# Altium schematic sheet 02_rf_front_end.SchDoc
size A3; SheetNumber: 2; SheetTotal: 2
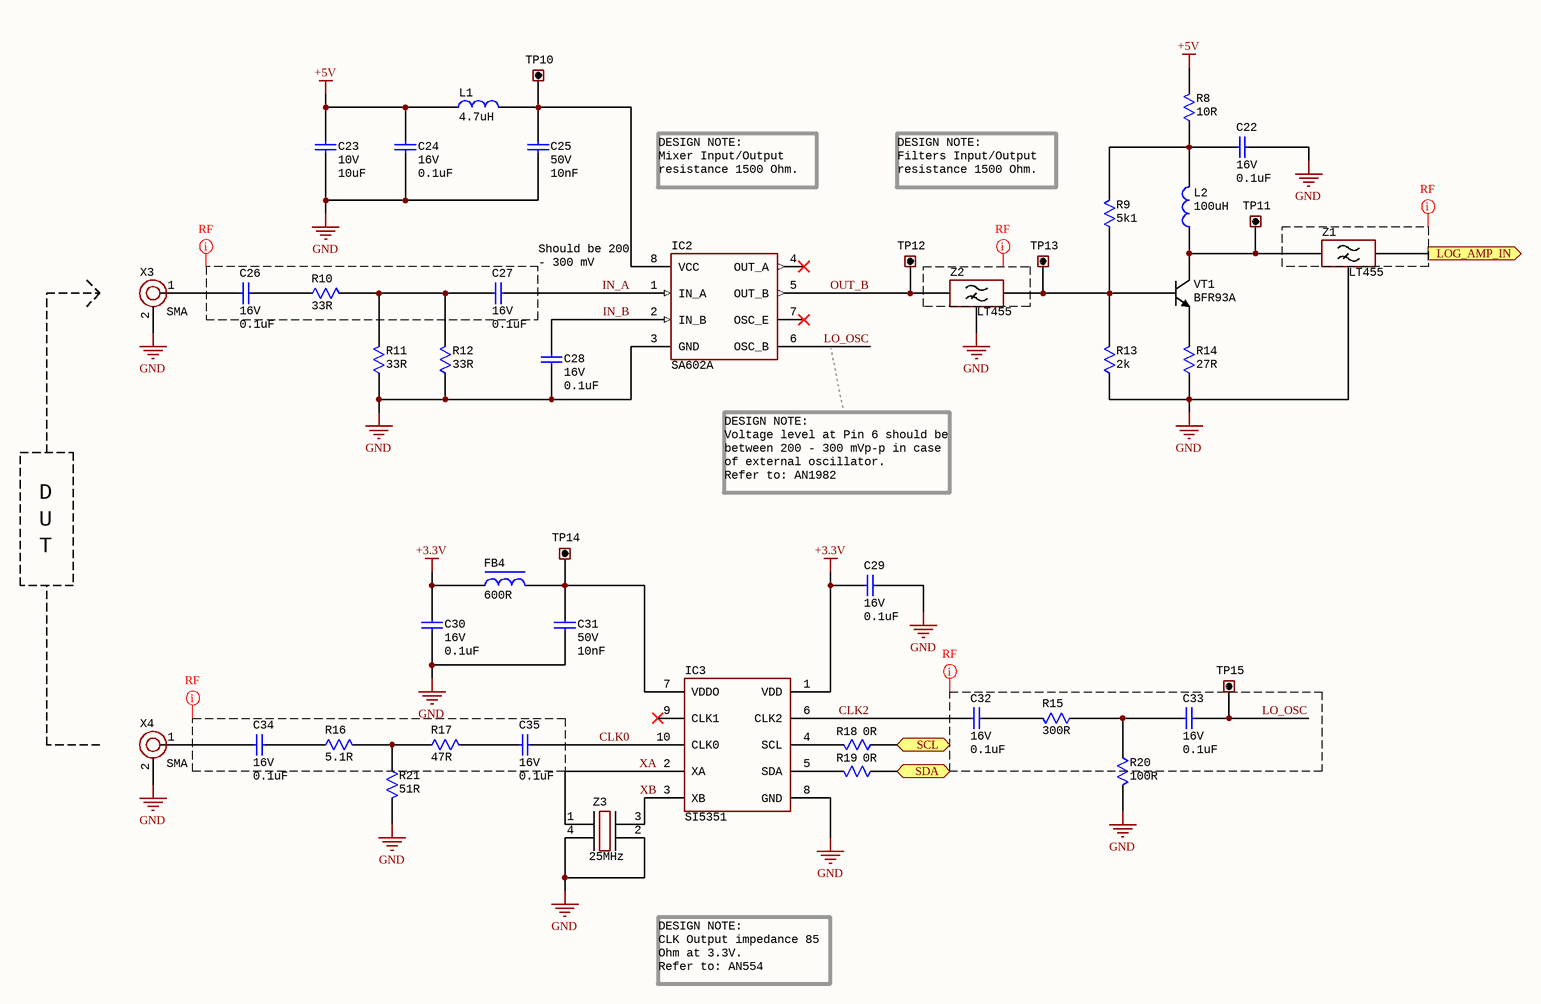
[diagram p0: 02_rf_front_end.SchDoc]

## Parts
C22  value 0.1uF  Voltage: 16V  [CAP: 0402]
C23  value 10uF  Voltage: 10V  [CAP: 0603]
C24  value 0.1uF  Voltage: 16V  [CAP: 0402]
C25  value 10nF  Voltage: 50V  [CAP: 0402]
C26  value 0.1uF  Voltage: 16V  [CAP: 0402]
C27  value 0.1uF  Voltage: 16V  [CAP: 0402]
C28  value 0.1uF  Voltage: 16V  [CAP: 0402]
C29  value 0.1uF  Voltage: 16V  [CAP: 0402]
C30  value 0.1uF  Voltage: 16V  [CAP: 0402]
C31  value 10nF  Voltage: 50V  [CAP: 0402]
C32  value 0.1uF  Voltage: 16V  [CAP: 0402]
C33  value 0.1uF  Voltage: 16V  [CAP: 0402]
C34  value 0.1uF  Voltage: 16V  [CAP: 0402]
C35  value 0.1uF  Voltage: 16V  [CAP: 0402]
FB4  Resistance: 600R  [IND: 0603]
IC2  SA602A  [8-SOIC]
IC3  SI5351  [10-MSOP]
L1  value 4.7uH  [IND: 0603]
L2  value 100uH  [IND: 0805]
R8  value 10R  [RES: 0603]
R9  value 5k1  [RES: 0603]
R10  value 33R  [RES: 0603]
R11  value 33R  [RES: 0603]
R12  value 33R  [RES: 0603]
R13  value 2k  [RES: 0603]
R14  value 27R  [RES: 0603]
R15  value 300R  [RES: 0603]
R16  value 5.1R  [RES: 0603]
R17  value 47R  [RES: 0603]
R18  value 0R  [RES: 0402]  (no BOM)
R19  value 0R  [RES: 0402]  (no BOM)
R20  value 100R  [RES: 0603]
R21  value 51R  [RES: 0603]
TP10  (no value)  [CON: test_point]  (no BOM)
TP11  (no value)  [CON: test_point]  (no BOM)
TP12  (no value)  [CON: test_point]  (no BOM)
TP13  (no value)  [CON: test_point]  (no BOM)
TP14  (no value)  [CON: test_point]  (no BOM)
TP15  (no value)  [CON: test_point]  (no BOM)
VT1  PartNumber: BFR93A  [SOT23]
X3  CommentText: SMA  [CON: SMA EDGE MOUNT]
X4  CommentText: SMA  [CON: SMA EDGE MOUNT]
Z1  (no value)  [CFUKG455]
Z2  (no value)  [CFUKG455]
Z3  Frequency: 25MHz  [OSC: 3225]

## Ports
LOG_AMP_IN (out, see 01_digital_back_end[1C]), SCL (bidir, see 01_digital_back_end[7C]), SDA (bidir, see 01_digital_back_end[7C])

## Nets
+3.3V: C29.1 C30.1 FB4.2 IC3.1(VDD)
+5V: C23.1 C24.1 L1.2 R8.2
GND: C22.2 C23.2 C24.2 C25.2 C28.1 C29.2 C30.2 C31.2 IC2.3(GND) IC3.8(GND) R11.1 R12.1 R13.1 R14.1 R20.1 R21.1 X3.2 X4.2 Z1.3(GND) Z2.3(GND) Z3.2 Z3.4
CLK0: C35.1 IC3.10(CLK0)
CLK2: C32.2 IC3.6(CLK2)
IN_A: C27.2 IC2.1(IN_A)
IN_B: C28.2 IC2.2(IN_B)
LO_OSC: C33.1 IC2.6(OSC_B) TP15.1
LOG_AMP_IN: Z1.2(OUT) ; port LOG_AMP_IN
OUT_B: IC2.5(OUT_B) TP12.1 Z2.1(IN)
SCL: R18.1 ; port SCL
SDA: R19.1 ; port SDA
XA: IC3.2(XA) Z3.1
XB: IC3.3(XB) Z3.3
NetC22_1: C22.1 L2.1 R8.1 R9.2
NetC25_1: C25.1 IC2.8(VCC) L1.1 TP10.1
NetC26_1: C26.1 X3.1
NetC26_2: C26.2 R10.1
NetC27_1: C27.1 R10.2 R11.2 R12.2
NetC31_1: C31.1 FB4.1 IC3.7(VDDO) TP14.1
NetC32_1: C32.1 R15.1
NetC33_2: C33.2 R15.2 R20.2
NetC34_1: C34.1 R16.2
NetC34_2: C34.2 X4.1
NetC35_2: C35.2 R17.1
NetIC3_4: IC3.4(SCL) R18.2
NetIC3_5: IC3.5(SDA) R19.2
NetL2_2: L2.2 TP11.1 VT1.3(C) Z1.1(IN)
NetR9_1: R9.1 R13.2 TP13.1 VT1.1(B) Z2.2(OUT)
NetR14_2: R14.2 VT1.2(E)
NetR16_1: R16.1 R17.2 R21.2

Not connected (* = marked no-connect by the designer): IC2 4(OUT_A)* 7(OSC_E)*; IC3 9(CLK1)*

## Layout directives
net class RF: (no net found under the mark), LO_OSC

## Notes on the sheet
- DESIGN NOTE:
  Mixer Input/Output resistance 1500 Ohm.
- DESIGN NOTE:
  Filters Input/Output resistance 1500 Ohm.
- Should be 200 - 300 mV
- D
- U
- DESIGN NOTE:
  Voltage level at Pin 6 should be between 200 - 300 mVp-p in case of external oscillator.
  Refer to: AN1982
- T
- DESIGN NOTE:
  CLK Output impedance 85 Ohm at 3.3V.
  Refer to: AN554

## Library data of the parts
C22 C24 C26-C30 C32-C35 = Ceramic: Manufacturer: Samsung Electro-Mechanics; PartNumber: CL05B104KO5NNNC; ValueManufacturerPartNumber: Ceramic capacitor, 0.1uF, X7R, ±10%, 16V, 0402, -55...+125°C; TypeCapacitor: Ceramic capacitor; Tolerance: ±10%; TypeDielectric: X7R; Package: 0402; HelpURL: https://jlcpcb.com/partdetail/1877-CL05B104KO5NNNC/C1525; Temperature: -55...+125°C; JLCPCB Part #: C1525
C23 = Ceramic: Manufacturer: Samsung Electro-Mechanics; PartNumber: CL10A106KP8NNNC; ValueManufacturerPartNumber: Ceramic capacitor, 10uF, X5R, ±10%, 10V, 0603, -55...+125°C; TypeCapacitor: Ceramic capacitor; Tolerance: ±10%; TypeDielectric: X5R; Package: 0603; HelpURL: https://jlcpcb.com/partdetail/20411-CL10A106KP8NNNC/C19702; Temperature: -55...+125°C; JLCPCB Part #: C19702
C25 C31 = Ceramic: Manufacturer: Samsung Electro-Mechanics; PartNumber: CL05B103KB5NNNC; ValueManufacturerPartNumber: Ceramic capacitor, 10nF, X7R, ±10%, 50V, 0402, -55...+125°C; TypeCapacitor: Ceramic capacitor; Tolerance: ±10%; TypeDielectric: X7R; Package: 0402; HelpURL: https://jlcpcb.com/partdetail/15869-CL05B103KB5NNNC/C15195; Temperature: -55...+125°C; JLCPCB Part #: C15195
FB4 = Ferrite_Bead_SMD: Manufacturer: Sunlord; PartNumber: LQP03TNR10J02D; TypeInductor: Ferrite Bead; MaxCurrent: 200mA; Frequency: 100 MHz; Package: 0603; HelpURL: https://www.digikey.com/product-detail/en/murata-electronics-north-america/LQP03TNR10J02D/490-6742-1-ND/3845939; ValueManufacturerPartNumber: =TypeInductor+', '+Value+', '+Tolerance+', '+Package+', '+MaxCurrent+', '+Temperature; Temperature: -55...+125°C; JLCPCB Part #: C1002
IC2 = SA602A: Integrated Circuit; Manufacturer_Name: NXP; Manufacturer_Part_Number: SA602AD/01,118; Datasheet Link: http://www.nxp.com/docs/en/data-sheet/SA602A.pdf; Height: 1.75mm; Mouser Part Number: 771-SA602AD/01-T; Mouser Price/Stock: https://www.mouser.co.uk/ProductDetail/NXP-Semiconductors/SA602AD-01118?qs=LOCUfHb8d9uqq1xhBWuUZQ%3D%3D; Arrow Part Number: SA602AD/01,118; Arrow Price/Stock: https://www.arrow.com/en/products/sa602ad01118/nxp-semiconductors?region=nac
IC3 = Si5351A: Integrated Circuit; Manufacturer_Name: Silicon Labs; Manufacturer_Part_Number: Si5351A-B-GT; Datasheet Link: https://componentsearchengine.com/Datasheets/1/Si5351A-B-GT.pdf; Height: 1.1mm; Mouser Part Number: 634-SI5351A-B-GT; Mouser Price/Stock: https://www.mouser.co.uk/ProductDetail/Silicon-Labs/SI5351A-B-GT?qs=p9T7GgSe1IEO%252BMfC%2FKPFfA%3D%3D; Arrow Part Number: SI5351A-B-GT; Arrow Price/Stock: https://www.arrow.com/en/products/si5351a-b-gt/silicon-labs; JLCPCB Part #: C504891
L1 = Inductor_SMD: Manufacturer: Murata Electronics; PartNumber: LQP03TNR10J02D; ValueManufacturerPartNumber: Fixed inductor, 4.7uH, ±5%, 0201, 80mA, -55...+125°C; TypeInductor: Fixed inductor; MaxCurrent: 80mA; Tolerance: ±5%; Package: 0201; HelpURL: https://www.digikey.com/product-detail/en/murata-electronics-north-america/LQP03TNR10J02D/490-6742-1-ND/3845939; Temperature: -55...+125°C; JLCPCB Part #: C1034
L2 = Inductor_SMD: Manufacturer: Murata Electronics; PartNumber: LQP03TNR10J02D; ValueManufacturerPartNumber: Fixed inductor, 100uH, ±5%, 0201, 80mA, -55...+125°C; TypeInductor: Fixed inductor; MaxCurrent: 80mA; Tolerance: ±5%; Package: 0201; HelpURL: https://www.digikey.com/product-detail/en/murata-electronics-north-america/LQP03TNR10J02D/490-6742-1-ND/3845939; Temperature: -55...+125°C
R8 = Resistor: Manufacturer: Yageo; PartNumber: RC0201JR-07100RL; ValueManufacturerPartNumber: Resistor film, 10R, ±5%, 0603, 0.05W, -55...+125°C; TypeResistor: Resistor film; Power: 0.05W; Tolerance: ±5%; Package: 0603; HelpURL: https://www.digikey.com/product-detail/en/yageo/RC0201JR-07100RL/311-100NCT-ND/1949006; Temperature: -55...+125°C
R9 = Resistor: Manufacturer: Yageo; PartNumber: RC0201JR-07100RL; ValueManufacturerPartNumber: Resistor film, 5k1, ±5%, 0603, 0.05W, -55...+125°C; TypeResistor: Resistor film; Power: 0.05W; Tolerance: ±5%; Package: 0603; HelpURL: https://www.digikey.com/product-detail/en/yageo/RC0201JR-07100RL/311-100NCT-ND/1949006; Temperature: -55...+125°C; JLCPCB Part #: C23186
R10-R12 = Resistor: Manufacturer: Yageo; PartNumber: RC0201JR-07100RL; ValueManufacturerPartNumber: Resistor film, 33R, ±5%, 0603, 0.05W, -55...+125°C; TypeResistor: Resistor film; Power: 0.05W; Tolerance: ±5%; Package: 0603; HelpURL: https://www.digikey.com/product-detail/en/yageo/RC0201JR-07100RL/311-100NCT-ND/1949006; Temperature: -55...+125°C; JLCPCB Part #: C23140
R13 = Resistor: Manufacturer: Yageo; PartNumber: RC0201JR-07100RL; ValueManufacturerPartNumber: Resistor film, 2k, ±5%, 0603, 0.05W, -55...+125°C; TypeResistor: Resistor film; Power: 0.05W; Tolerance: ±5%; Package: 0603; HelpURL: https://www.digikey.com/product-detail/en/yageo/RC0201JR-07100RL/311-100NCT-ND/1949006; Temperature: -55...+125°C; JLCPCB Part #: C22975
R14 = Resistor: Manufacturer: Yageo; PartNumber: RC0201JR-07100RL; ValueManufacturerPartNumber: Resistor film, 27R, ±5%, 0603, 0.05W, -55...+125°C; TypeResistor: Resistor film; Power: 0.05W; Tolerance: ±5%; Package: 0603; HelpURL: https://www.digikey.com/product-detail/en/yageo/RC0201JR-07100RL/311-100NCT-ND/1949006; Temperature: -55...+125°C; JLCPCB Part #: C25190
R15 = Resistor: Manufacturer: Yageo; PartNumber: RC0201JR-07100RL; ValueManufacturerPartNumber: Resistor film, 300R, ±5%, 0603, 0.05W, -55...+125°C; TypeResistor: Resistor film; Power: 0.05W; Tolerance: ±5%; Package: 0603; HelpURL: https://www.digikey.com/product-detail/en/yageo/RC0201JR-07100RL/311-100NCT-ND/1949006; Temperature: -55...+125°C; JLCPCB Part #: C23025
R16 = Resistor: Manufacturer: Yageo; PartNumber: RC0201JR-07100RL; ValueManufacturerPartNumber: Resistor film, 5.1R, ±5%, 0603, 0.05W, -55...+125°C; TypeResistor: Resistor film; Power: 0.05W; Tolerance: ±5%; Package: 0603; HelpURL: https://www.digikey.com/product-detail/en/yageo/RC0201JR-07100RL/311-100NCT-ND/1949006; Temperature: -55...+125°C; JLCPCB Part #: C25197
R17 = Resistor: Manufacturer: Yageo; PartNumber: RC0201JR-07100RL; ValueManufacturerPartNumber: Resistor film, 47R, ±5%, 0603, 0.05W, -55...+125°C; TypeResistor: Resistor film; Power: 0.05W; Tolerance: ±5%; Package: 0603; HelpURL: https://www.digikey.com/product-detail/en/yageo/RC0201JR-07100RL/311-100NCT-ND/1949006; Temperature: -55...+125°C; JLCPCB Part #: C23182
R18 R19 = Resistor: Manufacturer: Yageo; PartNumber: RC0201JR-07100RL; ValueManufacturerPartNumber: Resistor film, 0R, ±5%, 0603, 0.05W, -55...+125°C; TypeResistor: Resistor film; Power: 0.05W; Tolerance: ±5%; Package: 0603; HelpURL: https://www.digikey.com/product-detail/en/yageo/RC0201JR-07100RL/311-100NCT-ND/1949006; Temperature: -55...+125°C
R20 = Resistor: Manufacturer: Yageo; PartNumber: RC0201JR-07100RL; ValueManufacturerPartNumber: Resistor film, 100R, ±5%, 0603, 0.05W, -55...+125°C; TypeResistor: Resistor film; Power: 0.05W; Tolerance: ±5%; Package: 0603; HelpURL: https://www.digikey.com/product-detail/en/yageo/RC0201JR-07100RL/311-100NCT-ND/1949006; Temperature: -55...+125°C; JLCPCB Part #: C22775
R21 = Resistor: Manufacturer: Yageo; PartNumber: RC0201JR-07100RL; ValueManufacturerPartNumber: Resistor film, 51R, ±5%, 0603, 0.05W, -55...+125°C; TypeResistor: Resistor film; Power: 0.05W; Tolerance: ±5%; Package: 0603; HelpURL: https://www.digikey.com/product-detail/en/yageo/RC0201JR-07100RL/311-100NCT-ND/1949006; Temperature: -55...+125°C; JLCPCB Part #: C23197
TP10-TP15 = Connector_Test_Point: Manufacturer: Keystone; ValueManufacturerPartNumber: Test point, Keystone, 5001; PartNumber: 5001; TypeConnector: Test point; HelpURL: https://www.digikey.com/product-detail/en/keystone-electronics/5001/36-5001-ND/255327
VT1 = BJT_NPN_132: Manufacturer: ON Semiconductor; ValueManufacturerPartNumber: NPN transistor, 45V, 100mA, 100MHz, 300mW, 0.6V, 420, SOT-23, -55...+125°C; TypeTransistor: NPN transistor; VoltageCE: 45V; CurrentCE: 100mA; VoltageSaturation: 0.6V; Frequency: 100MHz; CurrentGain: 420; MaxPower: 300mW; Package: SOT-23; HelpURL: https://www.digikey.com/product-detail/en/on-semiconductor/BC847CLT1G/BC847CLT1GOSCT-ND/917836; Temperature: -55...+125°C
X3 X4 = Connector_SMA: Manufacturer: TE Connectivity; ValueManufacturerPartNumber: Connector SMA, 50 Ohm, 3GHz; PartNumber: 5-1814832-1; TypeConnector: Connector SMA; Frequency: 3GHz; Impedance: 50 Ohm; HelpURL: https://www.digikey.com/product-detail/en/te-connectivity-amp-connectors/5-1814832-1/A97594-ND/1755982
Z1 Z2 = LT455: PartNumber: LT455
Z3 = Oscilator: Manufacturer: Yangxing Tech; PartNumber: X322525MOB4SI; ValueManufacturerPartNumber: Oscilator, 25MHz, HCMOS, ±50ppm, case 3225, -20...+70°C; LoadCapacitance: HCMOS; Tolerance: ±50ppm; Package: case 3225; HelpURL: https://jlcpcb.com/partdetail/YangxingTech-X322525MOB4SI/C9006; Temperature: -20...+70°C; TypeOscilator: Oscilator; JLCPCB Part #: C9006